# EAGLE design LTC3105 (EAGLE 7.1.0)
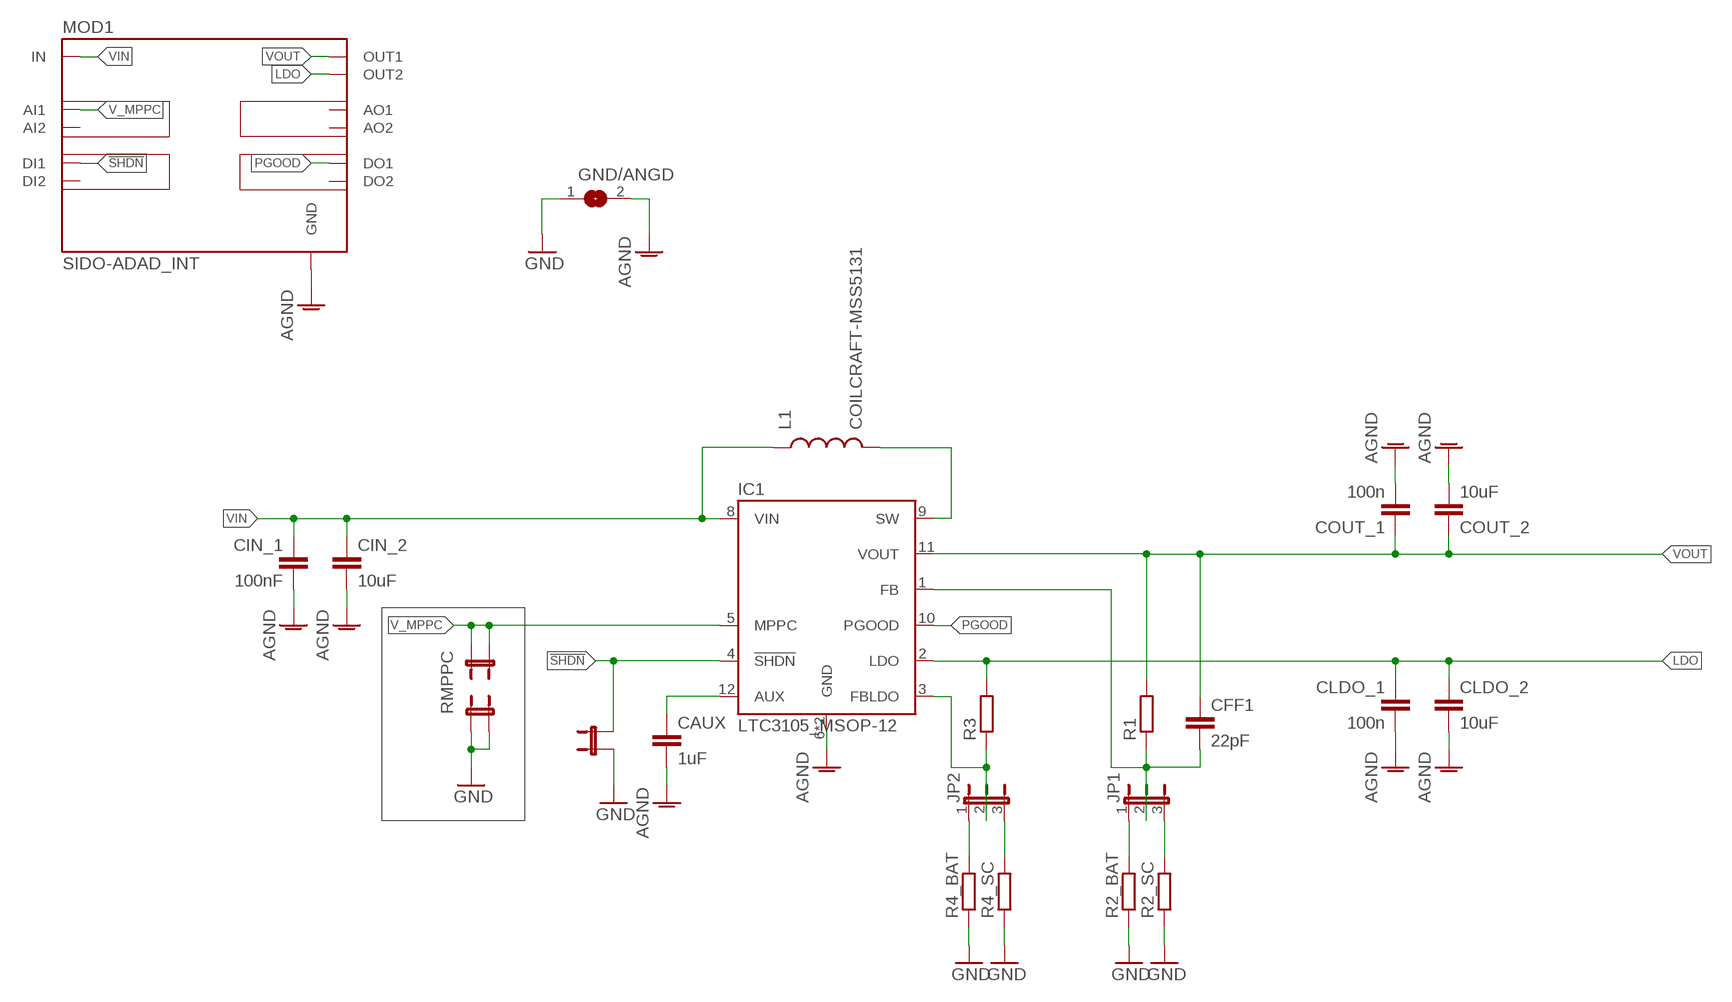
[diagram p0: schematic, sheet 1]

## Parts
CAUX  1uF  C-EUC0805K  [C0805K]
CFF1  22pF  C-EUC0805K  [C0805K]
CIN_1  100nF  C-EUC0805K  [C0805K]
CIN_2  10uF  C-EUC0805K  [C0805K]
CLDO_1  100n  C-EUC0805K  [C0805K]
CLDO_2  10uF  C-EUC0805K  [C0805K]
COUT_1  100n  C-EUC0805K  [C0805K]
COUT_2  10uF  C-EUC0805K  [C0805K]
GND/ANGD  SJ  [SJ]
IC1  LTC3105_MSOP-12  [MSOP-12]
JP1  JP2E  [JP2]
JP2  JP2E  [JP2]
JP3  JP2_SMALL_PAD  [JP2_SMALL_PAD]
JP4  JP2_SMALL_PAD  [JP2_SMALL_PAD]
JP5  JP2_SMALL_PAD  [JP2_SMALL_PAD]
L1  COILCRAFT-MSS5131  [COILCRAFT_MSS5131]
MOD1  SIDO-ADAD_INT  [SIDO-ADAD]
R1  R-EU_R0805  [R0805]
R2_BAT  R-EU_R0805  [R0805]
R2_SC  R-EU_R0805  [R0805]
R3  R-EU_R0805  [R0805]
R4_BAT  R-EU_R0805  [R0805]
R4_SC  R-EU_R0805  [R0805]

## Nets
!SHDN: IC1.4(!SHDN) JP5.2 MOD1.DI1
AGND: CAUX.2 CIN_1.2 CIN_2.2 CLDO_1.2 CLDO_2.2 COUT_1.2 COUT_2.2 GND/ANGD.2 IC1.6(GND) IC1.7(GND) MOD1.GND1(GND) MOD1.GND2(GND) MOD1.GND3(GND) MOD1.GND4(GND)
GND: GND/ANGD.1 JP4.1 JP4.2 JP5.1 R2_BAT.1 R2_SC.1 R4_BAT.1 R4_SC.1
LDO: CLDO_1.1 CLDO_2.1 IC1.2(LDO) MOD1.OUT2_1(OUT2) MOD1.OUT2_2(OUT2) MOD1.OUT2_3(OUT2) MOD1.OUT2_4(OUT2) R3.2
N$3: JP2.1 R4_BAT.2
N$4: CAUX.1 IC1.12(AUX)
N$5: IC1.9(SW) L1.P$1
N$6: JP2.3 R4_SC.2
N$8: IC1.3(FBLDO) JP2.2 R3.1
N$13: JP1.1 R2_BAT.2
N$19: JP1.3 R2_SC.2
N$20: CFF1.2 IC1.1(FB) JP1.2 R1.1
PGOOD: IC1.10(PGOOD) MOD1.DO1
V_MPPC: IC1.5(MPPC) JP3.1 JP3.2 MOD1.AI1
VIN: CIN_1.1 CIN_2.1 IC1.8(VIN) L1.P$2 MOD1.IN1(IN) MOD1.IN2(IN) MOD1.IN3(IN) MOD1.IN4(IN)
VOUT: CFF1.1 COUT_1.1 COUT_2.1 IC1.11(VOUT) MOD1.OUT1_1(OUT1) MOD1.OUT1_2(OUT1) MOD1.OUT1_3(OUT1) MOD1.OUT1_4(OUT1) R1.2
Unconnected: MOD1.AI2 MOD1.AO1 MOD1.AO2 MOD1.DI2 MOD1.DO2

## Notes on the sheet
- RMPPC

## Library data of the parts
CAUX CFF1 CIN_1 CIN_2 CLDO_1 CLDO_2 COUT_1 COUT_2 = rcl:C-EU: CAPACITOR, European symbol
GND/ANGD = jumper:SJ: SMD solder JUMPER
IC1 = LTC3105:LTC3105_MSOP-12
JP1 JP2 = Jumper_mod:JP2E: JUMPER
JP3-JP5 = Jumper_mod:JP2_SMALL_PAD
L1 = MSS5131:COILCRAFT-MSS5131
MOD1 = AllModules:SIDO-ADAD_INT
R1 R2_BAT R2_SC R3 R4_BAT R4_SC = rcl:R-EU_: RESISTOR, European symbol

## Board
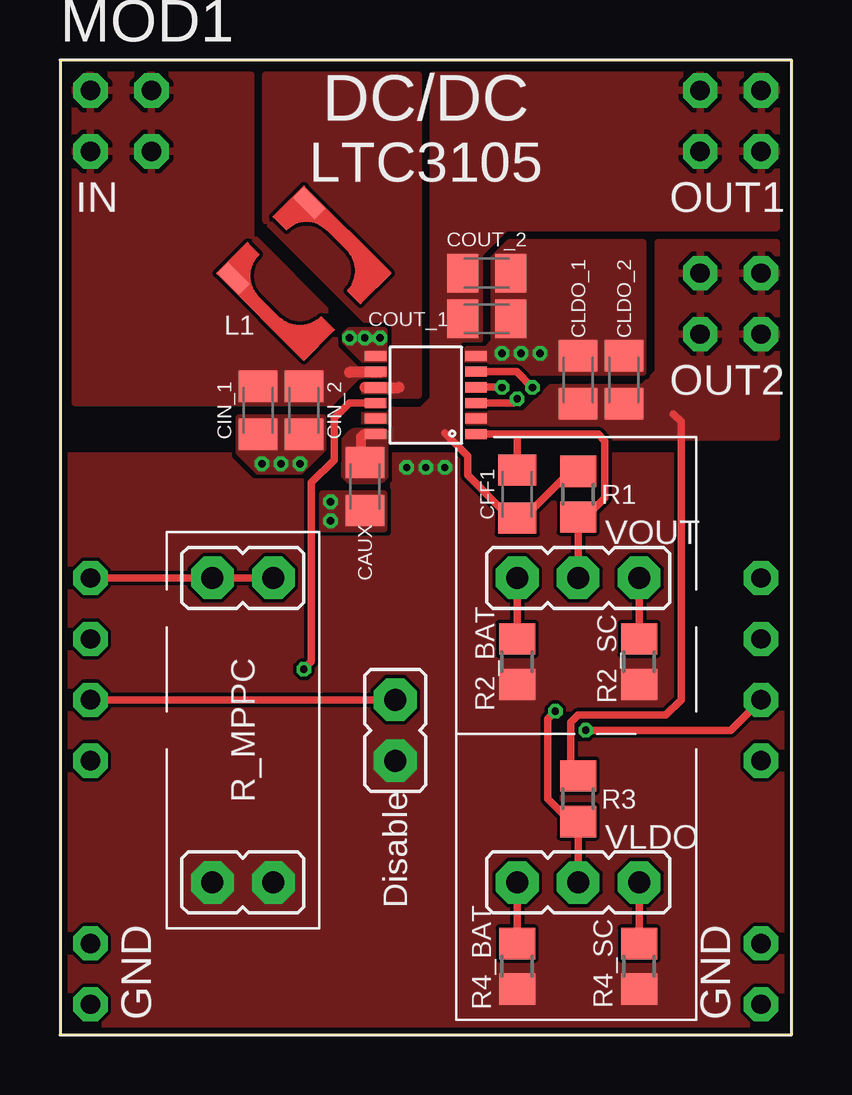
[diagram p1: board, top side]
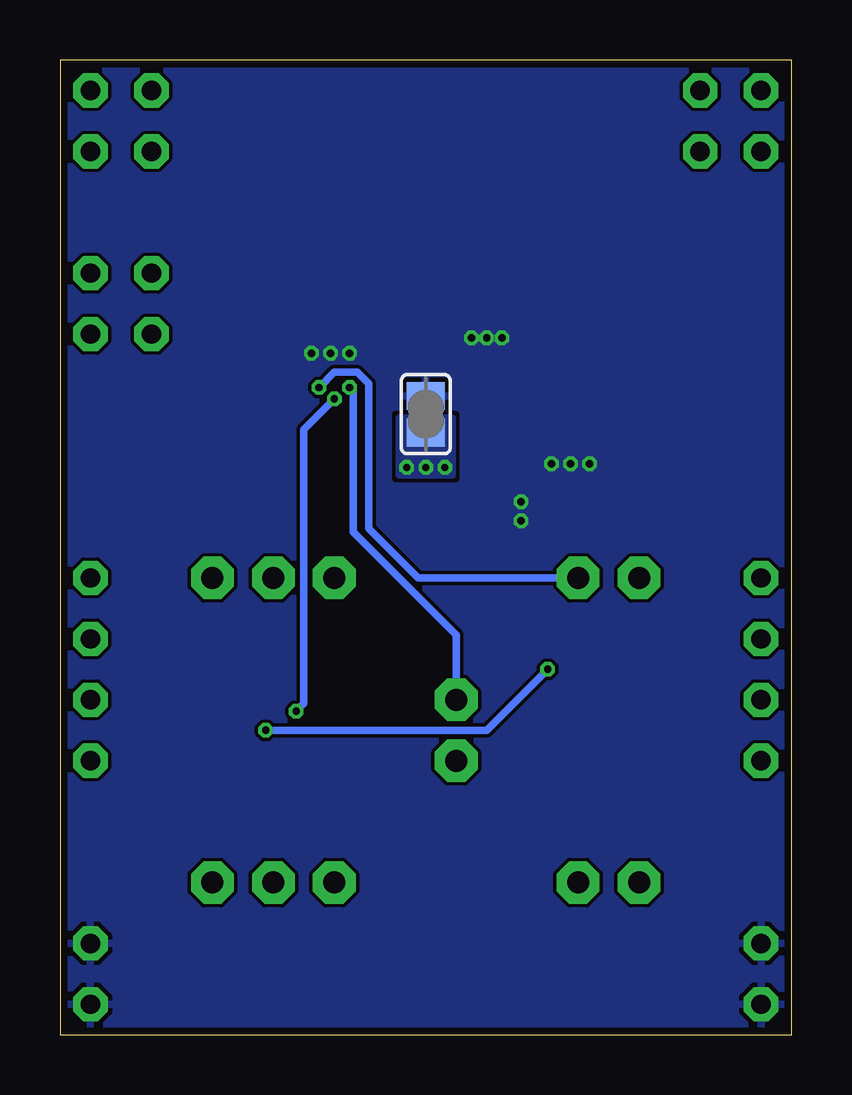
[diagram p2: board, bottom side, seen from below]

Size 30.48 x 40.64 mm. Coordinates in mm from the lower left corner, seen from the top.
Outline: 0,40.64 30.48,40.64 30.48,0 0,0 0,40.64
Copper layers (1*16): Top 0.035mm / dielectric 1.5mm / Bottom 0.035mm
Design rules "PCB-POOL Standard": minimum track width 0.15mm, minimum drill 0.3mm, track to track 0.15mm, track to pad 0.15mm, pad to pad 0.15mm, via to via 0.15mm, smd to smd 0.15mm, copper to edge 0.3mm, drill to drill 0.2mm, minimum pad ring 0.2mm, minimum via ring 0.15mm, stop-mask expansion 0.075mm, vias tented up to drill 0mil, thermal gap 0.2mm

### Footprints (pad centres in the part's own frame; a part is rotated, then mirrored left to right if it is on the bottom)
C0805K = smd 1.3 x 1.6: 1 -1,0; 2 1,0
SJ = smd 1.168 x 1.6: 1 -0.762,0; 2 0.762,0
MSOP-12 = smd 0.889 x 0.42: 1 -2.1,1.625; 2 -2.1,0.975; 3 -2.1,0.325; 4 -2.1,-0.325; 5 -2.1,-0.975; 6 -2.1,-1.625; 7 2.1,-1.625; 8 2.1,-0.975; 9 2.1,-0.325; 10 2.1,0.325; 11 2.1,0.975; 12 2.1,1.625
JP2 = drill 0.914 pad 1.778 octagon: 1 -2.54,0; 2 0,0; 3 2.54,0
JP2_SMALL_PAD = drill 0.914 pad 1.778 octagon: 1 -2.54,0; 2 0,0
COILCRAFT_MSS5131 = smd 1.27 x 0.635: P$1 -1.905,2.223; P$2 -1.905,-2.223
SIDO-ADAD = drill 0.8 pad 1.422 octagon: AI1 0,-20.32; AI2 0,-22.86; AO1 27.94,-20.32; AO2 27.94,-22.86; DI1 0,-25.4; DI2 0,-27.94; DO1 27.94,-25.4; DO2 27.94,-27.94; GND1 0,-38.1; GND2 0,-35.56; GND3 27.94,-35.56; GND4 27.94,-38.1; IN1 0,0; IN2 0,-2.54; IN3 2.54,0; IN4 2.54,-2.54; OUT1_1 25.4,0; OUT1_2 25.4,-2.54; OUT1_3 27.94,0; OUT1_4 27.94,-2.54; OUT2_1 25.4,-7.62; OUT2_2 25.4,-10.16; OUT2_3 27.94,-7.62; OUT2_4 27.94,-10.16
R0805 = smd 1.3 x 1.5: 1 -0.95,0; 2 0.95,0

### Placement (x,y rotation side)
CAUX  12.7,22.86 270 top
CFF1  19.05,22.54 90 top
CIN_1  8.26,26.03 270 top
CIN_2  10.16,26.03 270 top
CLDO_1  21.59,27.3 90 top
CLDO_2  23.5,27.3 90 top
COUT_1  17.78,29.84 0 top
COUT_2  17.78,31.75 0 top
GND/ANGD  15.24,25.88 90 bottom
IC1  15.24,26.67 180 top
JP1  21.59,19.05 0 top
JP2  21.59,6.35 0 top
JP3  8.89,19.05 0 top
JP4  8.89,6.35 0 top
JP5  13.97,13.97 90 top
L1  10.16,31.75 315 top
MOD1  1.27,39.37 0 top
R1  21.59,22.54 90 top
R2_BAT  19.05,15.56 90 top
R2_SC  24.13,15.56 90 top
R3  21.59,9.84 90 top
R4_BAT  19.05,2.86 90 top
R4_SC  24.13,2.86 90 top

### Tracks (layer width: path | path; a pad name or v marks a point on that pad's centre or on a via)
!SHDN  (via drill 0.3)
  Top 0.305: IC1.4 18.26,26.99 v18.41,26.99 | MOD1.DI1 JP5.2
  Bottom 0.305: v18.41,26.99 18.26,26.83 18.26,20.95 13.97,16.67 JP5.2
AGND  (via drill 0.3)
  other vias: 13.33,29.05 12.7,29.05 12.06,29.05 18.41,28.42 19.21,28.42 20,28.42 8.41,23.81 9.21,23.81 10,23.81 11.27,22.22 11.27,21.43
  pour Bottom (rank 3): -0.64,41.27 -0.64,-0.64 31.11,-0.64 31.11,41.27
  pour Top (no thermals): 16.99,27.62 24.29,27.62 24.29,33.02 18.73,33.02 18.1,32.38 18.1,28.89 17.78,28.57 16.99,28.57
  pour Top (no thermals): 11.91,28.89 11.91,29.21 12.06,29.37 13.49,29.37 13.49,28.1 12.7,28.1
  pour Top (no thermals): 7.46,25.72 7.46,24.29 8.26,23.49 10,23.49 10.95,24.45 10.95,25.72
  pour Top (no thermals): 10.95,22.54 10.95,21.11 13.49,21.11 13.49,22.54
GND  (via drill 0.3)
  other vias: 14.45,23.65 15.24,23.65 16.03,23.65
  pour Bottom (no thermals): 14.13,23.34 14.13,25.72 16.35,25.72 16.35,23.34
  pour Top (rank 2, no thermals): -1.27,24.13 -1.27,-1.27 31.75,-1.27 31.75,24.13
LDO
  Top 0.305: 25.56,25.88 25.88,25.56 25.88,13.97 25.24,13.33 21.59,13.33 21.27,13.02 21.27,11.11 R3.2
  pour Top: 29.84,33.02 25.4,33.02 25.4,27.94 29.84,27.94
  pour Top (rank 3, no thermals): 16.83,25.88 16.83,24.92 29.84,24.92 29.84,28.1 25.56,28.1 25.56,33.02 24.92,33.02 24.92,32.54 24.92,27.62 24.29,26.99 20.48,26.99 19.37,25.88
N$2
  Bottom 0.406: 15.24,26.67 15.24,25.4
N$3
  Top 0.305: R4_BAT.2 JP2.1
N$4
  Top 0.406: IC1.12 12.66,25.04 12.54,24.92 12.54,24.02 CAUX.1
  pour Top (no thermals): 13.49,25.08 12.22,25.08 11.91,24.76 11.91,23.34 12.06,23.18 13.33,23.18 13.49,23.34
N$5
  Top 0.457: 12.7,26.99 14.13,26.99
  pour Top (rank 3, no thermals): 8.57,40 8.57,33.97 12.7,29.84 13.65,29.84 13.97,29.53 13.97,27.62 13.65,27.3 12.7,27.3 12.7,26.67 14.92,26.67 14.92,40
N$6
  Top 0.305: R4_SC.2 JP2.3
N$8  (via drill 0.3)
  Top 0.305: R3.1 JP2.2 | IC1.3 18.88,26.34 v19.05,26.51 | 21.11,9.37 21.43,9.37 R3.1 | R3.1 21.27,8.89 20.32,9.84 20.32,13.18 v20.64,13.49
  Bottom 0.305: v19.05,26.51 20.32,25.24 20.32,13.81 v20.64,13.49
N$13
  Top 0.305: JP1.1 R2_BAT.2
N$19
  Top 0.305: JP1.3 R2_SC.2
N$20
  Top 0.305: IC1.1 19.05,25.04 | 19.05,25.04 22.42,25.04 22.7,24.76 22.7,22.38 22.22,21.91 21.91,21.91 R1.1 JP1.2 | CFF1.2 19.05,25.04
PGOOD  (via drill 0.3)
  Top 0.305: IC1.10 12.06,26.34 11.43,25.72 11.43,23.97 10.48,23.02 10.48,15.56 v10.16,15.24 | MOD1.DO1 27.94,12.7 v21.91,12.7
  Bottom 0.305: v10.16,15.24 12.7,12.7 v21.91,12.7
V_MPPC  (via drill 0.3)
  Top 0.305: JP3.2 JP3.1 MOD1.AI1 | IC1.5 19.03,27.64 v19.68,26.99
  Bottom 0.305: v19.68,26.99 19.05,27.62 18.1,27.62 17.62,27.15 17.62,21.11 15.56,19.05 JP3.2
VIN
  Top 0.457: 13.33,27.62 13.02,27.62 12.06,27.62 | IC1.8 13.16,27.62
  pour Top: 0.64,40 0.64,35.56 5.08,35.56 5.08,40
  pour Top (rank 2, no thermals): 0.64,35.56 0.64,26.35 11.27,26.35 12.38,27.46 13.49,27.46 13.49,27.94 12.38,27.94 11.43,28.89 11.43,29.84 7.94,33.34 7.94,40 5.08,40 5.08,35.56
VOUT
  Top 0.305: R1.2 21.27,23.49 | 21.12,23.02 R1.2 | 16.03,25.08 16.99,24.13 16.99,23.34 18.41,21.91 18.68,21.91 CFF1.1 19.32,21.54 21.27,23.49 R1.2
  pour Top: 29.84,40 25.4,40 25.4,35.56 29.84,35.56
  pour Top (rank 2, no thermals): 12.7,26.03 15.08,26.03 15.56,26.51 15.56,40 25.56,40 25.56,35.72 29.84,35.72 29.84,33.66 18.57,33.66 17.46,32.54 17.46,28.73 16.67,28.73 16.67,24.76 13.65,24.76 13.65,25.4 12.7,25.4

### Text on the board
tNames: DC/DC | LTC3105 | VOUT | R_MPPC | Disable | VLDO
bStop: by Kokert & Beckedahl / 25.04.2017